# Altium schematic sheet MCU.SchDoc
size A; SheetNumber: 2; SheetTotal: 4
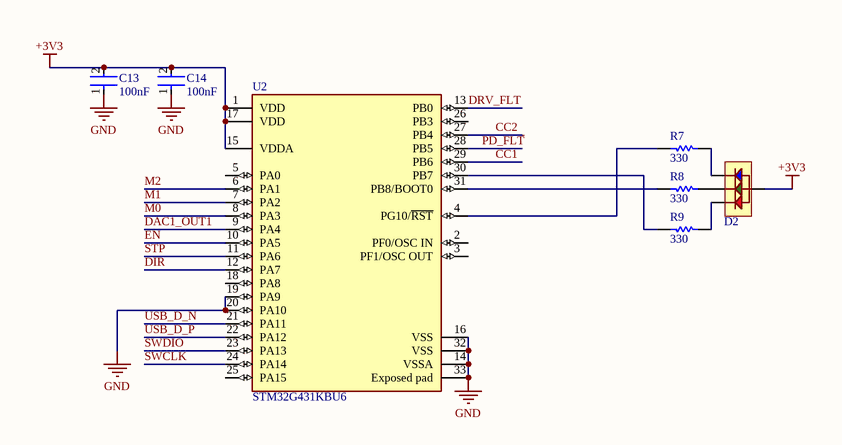
[diagram p0: MCU.SchDoc]

## Parts
C13  Capacitance: 100nF  [FP-C1005-050-0_05-IPC_C]  (hidden comment: C1005X7R1H104K050BB)
C14  Capacitance: 100nF  [FP-C1005-050-0_05-IPC_C]  (hidden comment: C1005X7R1H104K050BB)
D2  LED-RGB  [XL-2012RGBC]  (value not drawn)
R7  RESISTANCE: 330  [RESC1005X40X25NL05T05]  (hidden comment: ERJ-2GEJ331X)
R8  RESISTANCE: 330  [RESC1005X40X25NL05T05]  (hidden comment: ERJ-2GEJ331X)
R9  RESISTANCE: 330  [RESC1005X40X25NL05T05]  (hidden comment: ERJ-2GEJ331X)
U2  STM32G431KBU6  [FP-UFQFPN32-A0B8-IPC_A]

## Nets
+3V3: C13.2 C14.2 D2.3(COM) U2.1(VDD) U2.15(VDDA) U2.17(VDD)
GND: C13.1 C14.1 U2.14(VSSA) U2.16(VSS) U2.19(PA9) U2.20(PA10) U2.32(VSS) U2.33(Exposed_pad)
CC1: U2.29(PB6)
CC2: U2.27(PB4)
DAC1_OUT1: U2.9(PA4)
DIR: U2.12(PA7)
DRV_FLT: U2.13(PB0)
EN: U2.10(PA5)
M0: U2.8(PA3)
M1: U2.7(PA2)
M2: U2.6(PA1)
PD_~{FLT}: U2.28(PB5)
STP: U2.11(PA6)
SWCLK: U2.24(PA14)
SWDIO: U2.23(PA13)
USB_D_N: U2.21(PA11)
USB_D_P: U2.22(PA12)
NetD2_1: D2.1(R) R9.2
NetD2_2: D2.2(G) R8.2
NetD2_4: D2.4(B) R7.2
NetR7_1: R7.1 U2.4(PG10/~{RST})
NetR8_1: R8.1 U2.31(PB8/BOOT0)
NetR9_1: R9.1 U2.30(PB7)

Not connected (* = marked no-connect by the designer): U2 2(PF0/OSC_IN) 3(PF1/OSC_OUT) 5(PA0) 18(PA8) 25(PA15) 26(PB3)

## Library data of the parts
C13 C14 = CMP-2000-05393-2: Multilayer Ceramic Capacitors 100nF ±10% 50V X7R SMD 0402; Voltage: 50V; Dielectric Material: Ceramic; Min Operating Temperature: -55°C; Depth: 0.5mm; Radiation Hardening: No; RoHS Compliant: Yes; Voltage Rating (DC): 50V; Lead Free: Lead Free; Resistor Type: Ceramic; Height: 0.5mm; Dielectric: X7R; Thickness: 0.022inch; Case/Package: 0402; Case Code (Metric): 1005; Termination: SMD/SMT; Packaging: Tape and Reel; Max Operating Temperature: 125°C; Mount: Surface Mount; Package Quantity: 1; Width: 0.02inch; Weight: 2.3E-05oz; Voltage Rating: 50V; Tolerance: 10%; Construction: Flat; Case Code (Imperial): 0402; Length: 1mm; REACH SVHC: No SVHC; Series: C
D2 = XL-2012RGBC
R7-R9 = CMP-2002-00515-1: Manufacturer: Panasonic; Part Number: ERJ-2GEJ331X
U2 = CMP-12105-000119-1: IC MCU 32BIT 128KB FLSH 32UFQFPN; RoHS Compliant: Yes